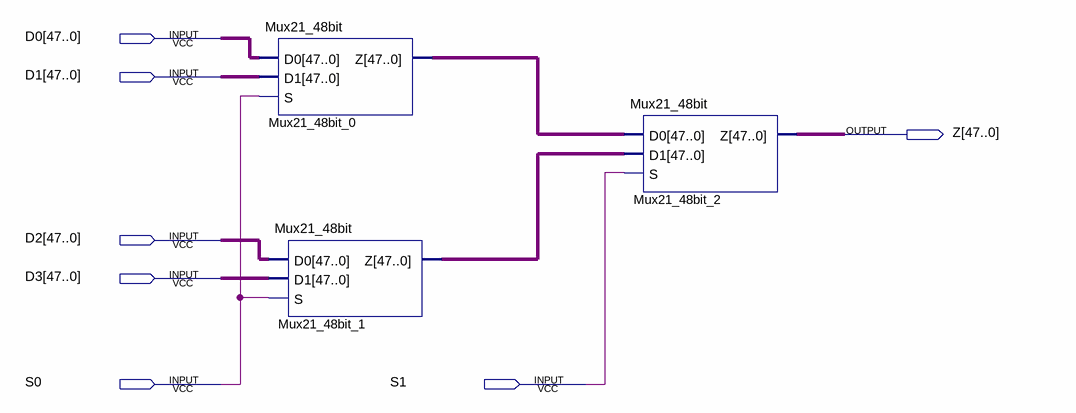
[diagram p0: schematic sheet]
// Quartus schematic Mux41_48bit.bdf as structural Verilog: 3 symbols, 7 pins
module Mux41_48bit (
  input  [47:0] D0,
  input  [47:0] D1,
  input  [47:0] D2,
  input  [47:0] D3,
  input  S0,
  input  S1,
  output [47:0] Z
);

  wire [47:0] Mux21_48bit_0_z, Mux21_48bit_1_z;

  Mux21_48bit Mux21_48bit_0 (.D0(D0), .D1(D1), .S(S0), .Z(Mux21_48bit_0_z));
  Mux21_48bit Mux21_48bit_1 (.D0(D2), .D1(D3), .S(S0), .Z(Mux21_48bit_1_z));
  Mux21_48bit Mux21_48bit_2 (.D0(Mux21_48bit_0_z), .D1(Mux21_48bit_1_z), .S(S1), .Z(Z));
endmodule
